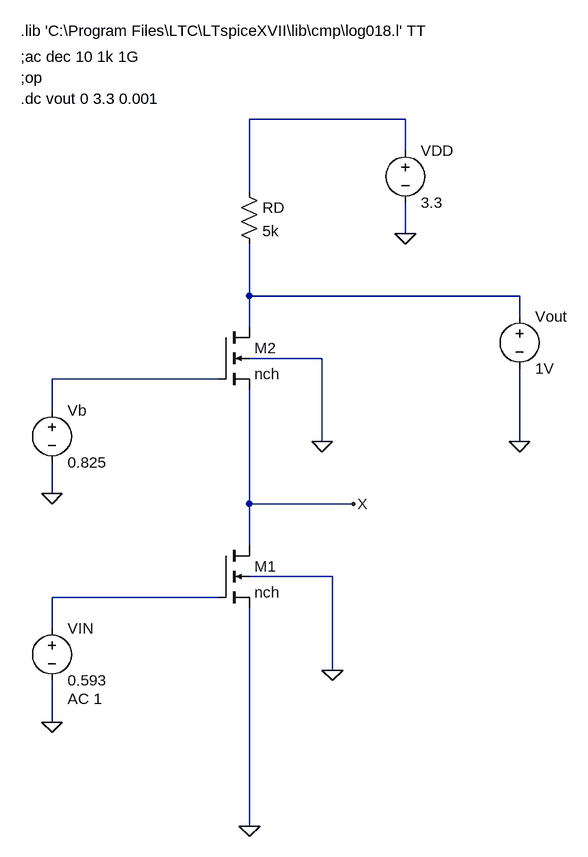
[diagram p0: schematic cascode.asc]
cascode.asc, the LTspice schematic file:
Version 4
SHEET 1 880 1220
WIRE 448 112 208 112
WIRE 448 160 448 112
WIRE 208 224 208 112
WIRE 448 288 448 240
WIRE 208 384 208 304
WIRE 624 384 208 384
WIRE 624 416 624 384
WIRE 208 432 208 384
WIRE 320 480 208 480
WIRE 160 512 -96 512
WIRE -96 560 -96 512
WIRE 320 608 320 480
WIRE 624 608 624 496
WIRE -96 688 -96 640
WIRE 208 704 208 528
WIRE 368 704 208 704
WIRE 208 768 208 704
WIRE 336 816 208 816
WIRE 160 848 -96 848
WIRE -96 896 -96 848
WIRE 336 960 336 816
WIRE -96 1040 -96 976
WIRE 208 1200 208 864
FLAG 448 288 0
FLAG 208 1200 0
FLAG -96 688 0
FLAG 320 608 0
FLAG 336 960 0
FLAG -96 1040 0
FLAG 368 704 X
FLAG 624 608 0
SYMBOL nmos4 160 768 R0
SYMATTR InstName M1
SYMATTR Value nch
SYMATTR Value2 l=0.36u w=36u
SYMBOL voltage 448 144 R0
WINDOW 123 0 0 Left 0
WINDOW 39 0 0 Left 0
SYMATTR InstName VDD
SYMATTR Value 3.3
SYMBOL voltage -96 880 R0
WINDOW 123 24 124 Left 2
WINDOW 39 0 0 Left 0
SYMATTR Value2 AC 1
SYMATTR InstName VIN
SYMATTR Value 0.593
SYMBOL voltage -96 544 R0
WINDOW 123 0 0 Left 0
WINDOW 39 0 0 Left 0
SYMATTR InstName Vb
SYMATTR Value 0.825
SYMBOL res 192 208 R0
SYMATTR InstName RD
SYMATTR Value 5k
SYMBOL nmos4 160 432 R0
SYMATTR InstName M2
SYMATTR Value nch
SYMATTR Value2 l=0.18u w=18u
SYMBOL voltage 624 400 R0
SYMATTR InstName Vout
SYMATTR Value 1V
TEXT -144 -24 Left 2 !.lib 'C:\\Program Files\\LTC\\LTspiceXVII\\lib\\cmp\\log018.l' TT
TEXT -144 16 Left 2 !;ac dec 10 1k 1G
TEXT -144 48 Left 2 !;op
TEXT -144 80 Left 2 !.dc vout 0 3.3 0.001

The netlist it stands for:
* cascode.asc
M1 X N004 0 0 nch l=0.36u w=36u
VDD N001 0 3.3
VIN N004 0 0.593 AC 1
Vb N003 0 0.825
RD N001 N002 5k
M2 N002 N003 X 0 nch l=0.18u w=18u
Vout N002 0 1V
.model NMOS NMOS
.model PMOS PMOS
.lib standard.mos
.lib 'C:\Program Files\LTC\LTspiceXVII\lib\cmp\log018.l' TT
;ac dec 10 1k 1G
;op
.dc vout 0 3.3 0.001
.backanno
.end

* Results of the author's LTspice run, read from the files saved beside the schematic
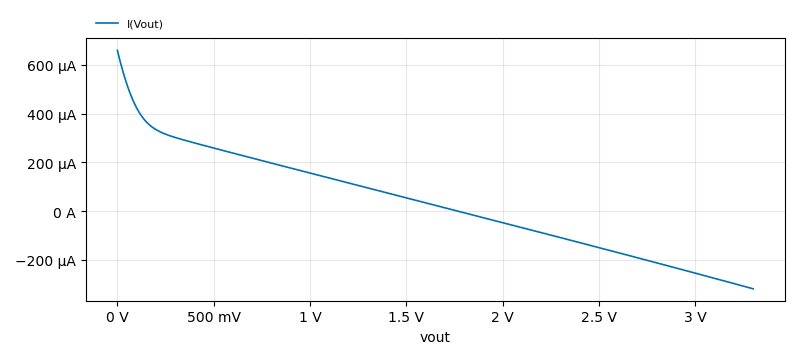
[diagram p1: DC transfer characteristic of cascode.asc, plotted from the saved traces]
* DC transfer characteristic, 1 run:
*   I(Vout): 660 µA at vout=0 V, -318.4 µA at vout=3.3 V, min -318.4 µA, max 660 µA